# Altium schematic sheet Microcontroller.SchDoc
size A; SheetNumber: 3; SheetTotal: 4
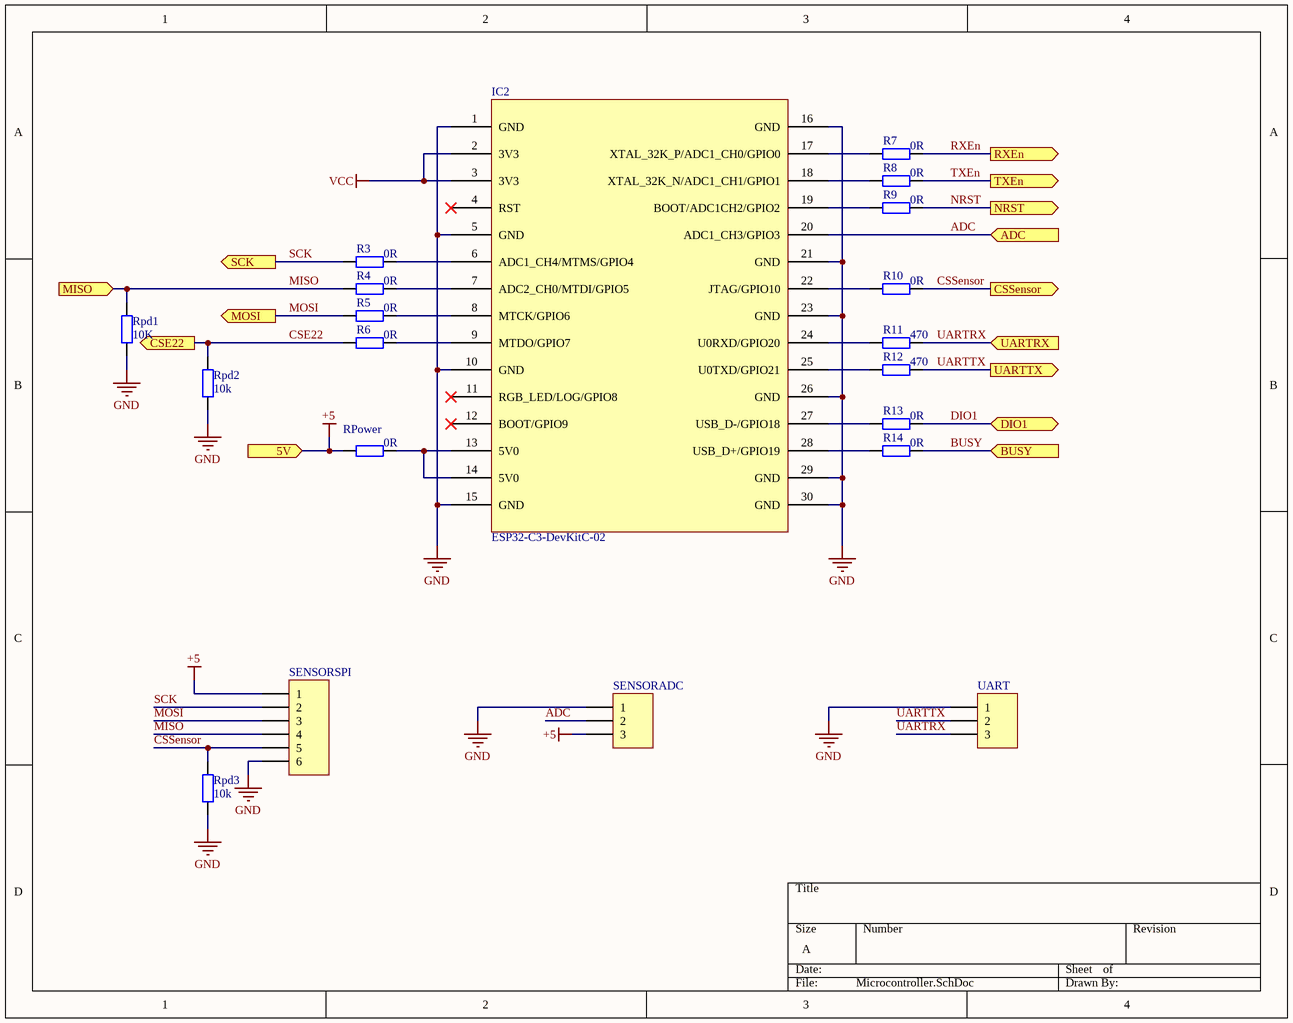
[diagram p0: Microcontroller.SchDoc]

## Parts
IC2  ESP32-C3-DevKitC-02  [ESP32-C3-DevKitC-02]
R3  value 0R  [RES0805]  (hidden comment: Res2)
R4  value 0R  [RES0805]  (hidden comment: Res2)
R5  value 0R  [RES0805]  (hidden comment: Res2)
R6  value 0R  [RES0805]  (hidden comment: Res2)
R7  value 0R  [RES0805]  (hidden comment: Res2)
R8  value 0R  [RES0805]  (hidden comment: Res2)
R9  value 0R  [RES0805]  (hidden comment: Res2)
R10  value 0R  [RES0805]  (hidden comment: Res2)
R11  value 470  [RES0805]  (hidden comment: Res2)
R12  value 470  [RES0805]  (hidden comment: Res2)
R13  value 0R  [RES0805]  (hidden comment: Res2)
R14  value 0R  [RES0805]  (hidden comment: Res2)
Rpd1  value 10K  [RES0805]  (hidden comment: Res2)
Rpd2  value 10k  [RES0805]  (hidden comment: Res2)
Rpd3  value 10k  [RES0805]  (hidden comment: Res2)
RPower  value 0R  [RES0805]  (hidden comment: Res2)
SENSORADC  Header 3  [Conn 1x3P]  (value not drawn)
SENSORSPI  Header 6  [Conn 1x6P]  (value not drawn)
UART  Header 3  [Conn 1x3P]  (value not drawn)

## Ports
5V (in), ADC (in), BUSY (in), CSE22 (out), CSSensor (out), DIO1 (bidir), MISO (in), MOSI (out), NRST (out), RXEn (out), SCK (out), TXEn (out), UARTRX (in), UARTTX (out)

## Nets
+5: RPower.1 SENSORADC.3 SENSORSPI.1 ; port 5V
GND: IC2.1(GND) IC2.5(GND) IC2.10(GND) IC2.15(GND) IC2.16(GND) IC2.21(GND) IC2.23(GND) IC2.26(GND) IC2.29(GND) IC2.30(GND) Rpd1.1 Rpd2.1 Rpd3.1 SENSORADC.1 SENSORSPI.6 UART.1
VCC: IC2.2(3V3) IC2.3(3V3)
ADC: IC2.20(ADC1_CH3/GPIO3) SENSORADC.2 ; port ADC
BUSY: R14.2 ; port BUSY
CSE22: R6.1 Rpd2.2 ; port CSE22
CSSensor: R10.2 Rpd3.2 SENSORSPI.5 ; port CSSensor
DIO1: R13.2 ; port DIO1
MISO: R4.1 Rpd1.2 SENSORSPI.4 ; port MISO
MOSI: R5.1 SENSORSPI.3 ; port MOSI
NRST: R9.2 ; port NRST
RXEn: R7.2 ; port RXEn
SCK: R3.1 SENSORSPI.2 ; port SCK
TXEn: R8.2 ; port TXEn
UARTRX: R11.2 UART.3 ; port UARTRX
UARTTX: R12.2 UART.2 ; port UARTTX
NetIC2_6: IC2.6(ADC1_CH4/MTMS/GPIO4) R3.2
NetIC2_7: IC2.7(ADC2_CH0/MTDI/GPIO5) R4.2
NetIC2_8: IC2.8(MTCK/GPIO6) R5.2
NetIC2_9: IC2.9(MTDO/GPIO7) R6.2
NetIC2_13: IC2.13(5V0) IC2.14(5V0) RPower.2
NetIC2_17: IC2.17(XTAL_32K_P/ADC1_CH0/GPIO0) R7.1
NetIC2_18: IC2.18(XTAL_32K_N/ADC1_CH1/GPIO1) R8.1
NetIC2_19: IC2.19(BOOT/ADC1CH2/GPIO2) R9.1
NetIC2_22: IC2.22(JTAG/GPIO10) R10.1
NetIC2_24: IC2.24(U0RXD/GPIO20) R11.1
NetIC2_25: IC2.25(U0TXD/GPIO21) R12.1
NetIC2_27: IC2.27(USB_D-/GPIO18) R13.1
NetIC2_28: IC2.28(USB_D+/GPIO19) R14.1

Not connected (* = marked no-connect by the designer): IC2 4(RST)* 11(RGB_LED/LOG/GPIO8)* 12(BOOT/GPIO9)*

## Library data of the parts
IC2 = ESP32-C3-DevKitC-02: ESP32-C3-DevKitC-02 is an entry-level development board based on ESP32-C3-WROOM-02, a general-purpose module with 4 MB SPI flash. This board integrates complete Wi-Fi and Bluetooth LE functions.; Datasheet: https://docs.espressif.com/projects/esp-idf/en/latest/esp32c3/hw-reference/esp32c3/user-guide-devkitc-02.html
R3-R14 Rpd1-Rpd3 RPower = Res2: Resistor; Published: 8-Jun-2000; LatestRevisionDate: 17-Jul-2002; LatestRevisionNote: Re-released for DXP Platform.; PackageReference: 0805; Publisher: Altium Limited; PackageDescription: 0805; LCSC Part #: C2074219
SENSORADC UART = Header 3: Header, 3-Pin; LatestRevisionDate: 17-Jul-2002; LatestRevisionNote: Re-released for DXP Platform.; Publisher: Altium Limited
SENSORSPI = Header 6: Header, 6-Pin; LatestRevisionDate: 17-Jul-2002; LatestRevisionNote: Re-released for DXP Platform.; Publisher: Altium Limited